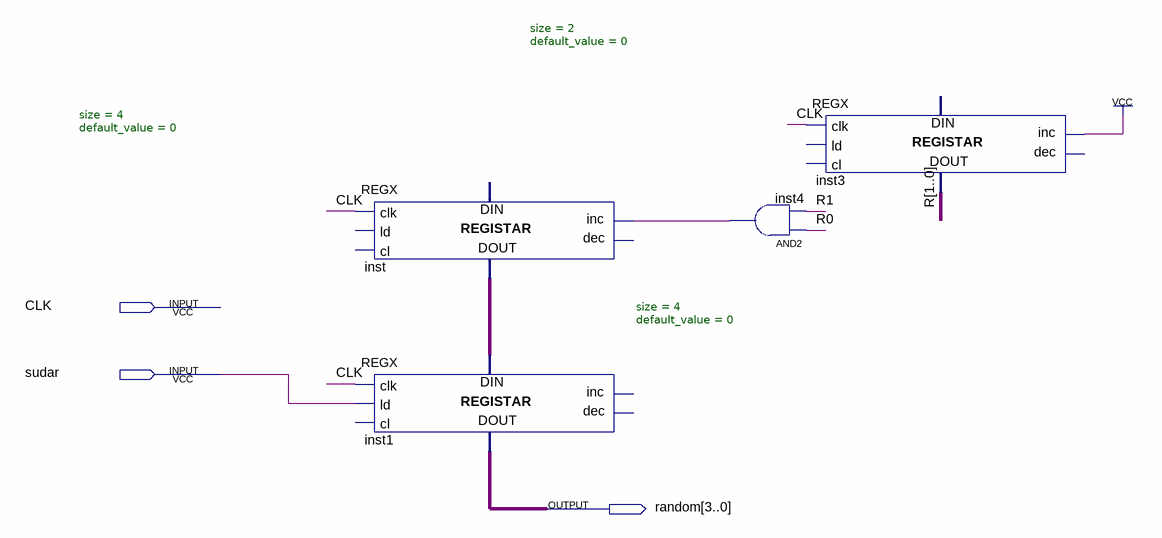
[diagram p0: schematic sheet]
// Quartus schematic RAND2.bdf as structural Verilog: 4 symbols, 3 pins
module RAND2 (
  input  CLK,
  input  sudar,
  output [3:0] random
);

  wire inst4_out;
  wire [1:0] R;
  wire [3:0] inst_data_out;

  REGX #(.size(4), .default_value(0)) inst (
    .clk(CLK), .inc(inst4_out), .data_out(inst_data_out));  // open: ld, cl, dec, data_in
  REGX #(.size(4), .default_value(0)) inst1 (
    .clk(CLK), .ld(sudar), .data_in(inst_data_out), .data_out(random));  // open: cl, inc, dec
  and inst4 (inst4_out, R[0], R[1]);
  REGX #(.size(2), .default_value(0)) inst3 (.clk(CLK), .inc(1'b1), .data_out(R));  // open: ld, cl, dec, data_in
endmodule
